# EAGLE design LED_base_left (EAGLE 9.6.2)
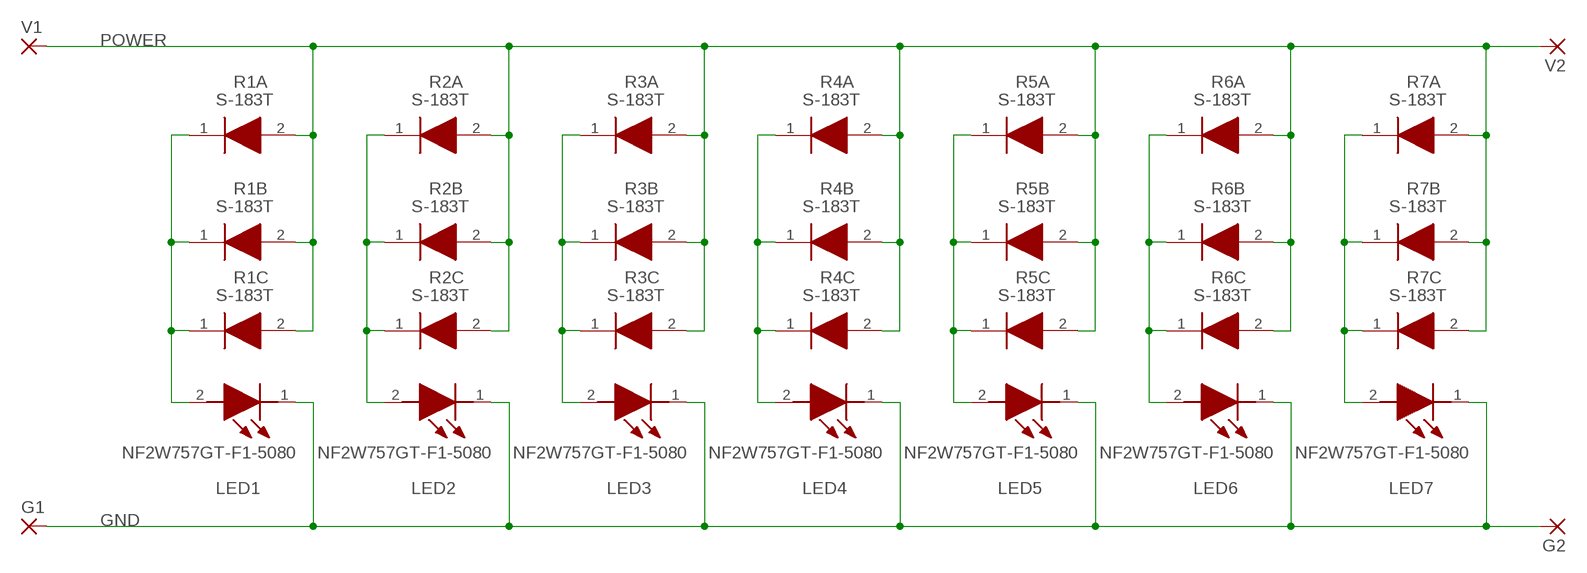
[diagram p0: schematic, sheet 1]

## Parts
G1  SMD_FULL  [SMD3.5-2.5]
G2  SMD_HALF  [SMD1.75-2.5]
LED1  NF2W757GT-F1-5080  [NF2W757DRTX]
LED2  NF2W757GT-F1-5080  [NF2W757DRTX]
LED3  NF2W757GT-F1-5080  [NF2W757DRTX]
LED4  NF2W757GT-F1-5080  [NF2W757DRTX]
LED5  NF2W757GT-F1-5080  [NF2W757DRTX]
LED6  NF2W757GT-F1-5080  [NF2W757DRTX]
LED7  NF2W757GT-F1-5080  [NF2W757DRTX]
R1A  S-183T  [SODFL3516X70NX]
R1B  S-183T  [SODFL3516X70NX]
R1C  S-183T  [SODFL3516X70NX]
R2A  S-183T  [SODFL3516X70NX]
R2B  S-183T  [SODFL3516X70NX]
R2C  S-183T  [SODFL3516X70NX]
R3A  S-183T  [SODFL3516X70NX]
R3B  S-183T  [SODFL3516X70NX]
R3C  S-183T  [SODFL3516X70NX]
R4A  S-183T  [SODFL3516X70NX]
R4B  S-183T  [SODFL3516X70NX]
R4C  S-183T  [SODFL3516X70NX]
R5A  S-183T  [SODFL3516X70NX]
R5B  S-183T  [SODFL3516X70NX]
R5C  S-183T  [SODFL3516X70NX]
R6A  S-183T  [SODFL3516X70NX]
R6B  S-183T  [SODFL3516X70NX]
R6C  S-183T  [SODFL3516X70NX]
R7A  S-183T  [SODFL3516X70NX]
R7B  S-183T  [SODFL3516X70NX]
R7C  S-183T  [SODFL3516X70NX]
V1  SMD_FULL  [SMD3.5-2.5]
V2  SMD_HALF  [SMD1.75-2.5]

## Nets
GND [PWRGND]: G1.1(P) G2.1(P) LED1.1(K) LED2.1(K) LED3.1(K) LED4.1(K) LED5.1(K) LED6.1(K) LED7.1(K)
N$1: LED1.2(A) R1A.1(K) R1B.1(K) R1C.1(K)
N$2: LED2.2(A) R2A.1(K) R2B.1(K) R2C.1(K)
N$3: LED3.2(A) R3A.1(K) R3B.1(K) R3C.1(K)
N$4: LED4.2(A) R4A.1(K) R4B.1(K) R4C.1(K)
N$5: LED5.2(A) R5A.1(K) R5B.1(K) R5C.1(K)
N$6: LED6.2(A) R6A.1(K) R6B.1(K) R6C.1(K)
N$7: LED7.2(A) R7A.1(K) R7B.1(K) R7C.1(K)
POWER [PWRGND]: R1A.2(A) R1B.2(A) R1C.2(A) R2A.2(A) R2B.2(A) R2C.2(A) R3A.2(A) R3B.2(A) R3C.2(A) R4A.2(A) R4B.2(A) R4C.2(A) R5A.2(A) R5B.2(A) R5C.2(A) R6A.2(A) R6B.2(A) R6C.2(A) R7A.2(A) R7B.2(A) R7C.2(A) V1.1(P) V2.1(P)

## Library data of the parts
G1 V1 = LED_base:SMD_FULL: SMD PAD
G2 V2 = LED_base:SMD_HALF: SMD PAD
LED1-LED7 = LED_base:NF2W757GT-F1-5080: Nichia NF2W757GT-F1-5080, 5000K Bi-colour White LED, 5080 Diffused SMD package Source: Datasheet <http://uk.rs-online.com/web/p/products/1372170>; DESCRIPTION: Nichia NF2W757GT-F1-5080, 5000K Bi-colour White LED, 5080 Diffused SMD package; HEIGHT: mm; MANUFACTURER_NAME: NICHIA; MANUFACTURER_PART_NUMBER: NF2W757GT-F1-5080; RS_PART_NUMBER: 1372170; RS_PRICE-STOCK: http://uk.rs-online.com/web/p/products/1372170
R1A R1B R1C R2A R2B R2C R3A R3B R3C R4A R4B R4C R5A R5B R5C R6A R6B R6C R7A R7B R7C = LED_base:S-183T: SEMITEC S-183T Constant Current Diode, 20mA, 4.6V max, 2-Pin SMD Source: Datasheet <https://componentsearchengine.com/Datasheets/1/S-183T.pdf>; DESCRIPTION: SEMITEC S-183T Constant Current Diode, 20mA, 4.6V max, 2-Pin SMD; HEIGHT: 0.7mm; MANUFACTURER_NAME: Semitec; MANUFACTURER_PART_NUMBER: S-183T; MOUSER_PART_NUMBER: 954-S-183T; MOUSER_PRICE-STOCK: https://www.mouser.com/Search/Refine.aspx?Keyword=954-S-183T

## Net classes
0 default: width 0.203 mm, clearance 0.203 mm
1 PWRGND: width 0.406 mm, clearance 0.203 mm to class 0, clearance 0.203 mm

## Board
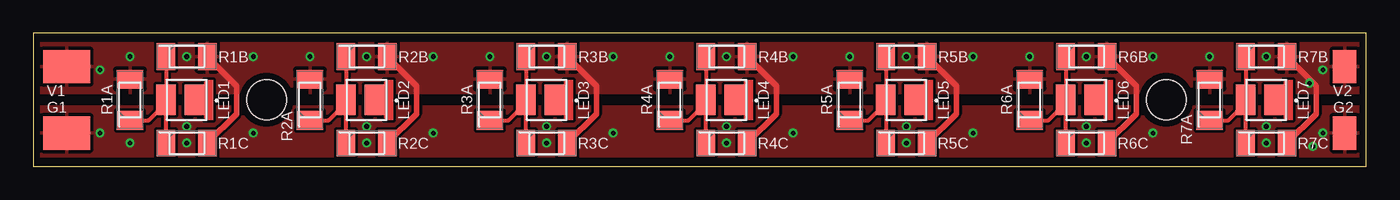
[diagram p1: board, top side]
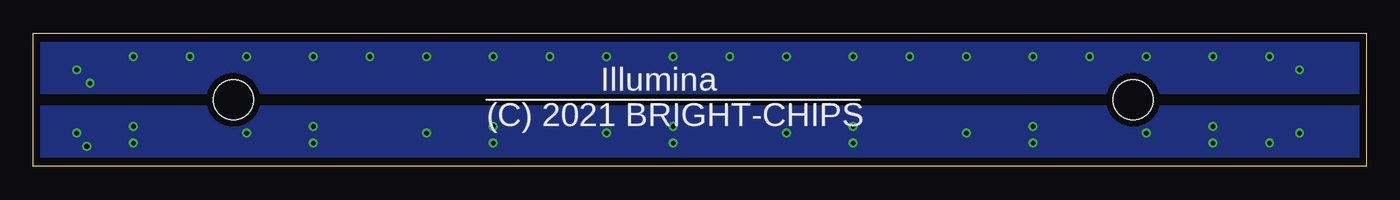
[diagram p2: board, bottom side, seen from below]

Size 100 x 10 mm. Coordinates in mm from the lower left corner, seen from the top.
Outline: 0,0 100,0 100,10 0,10 0,0
Copper layers (1*16): Top 0.035mm / dielectric 1.6mm / Bottom 0.035mm
Design rules "Elecrow_2-layer_PCB_eagle_rule": minimum track width 6mil, minimum drill 12mil, track to track 6mil, track to pad 6mil, pad to pad 6mil, via to via 8mil, smd to smd 0mil, copper to edge 20mil, drill to drill 10mil, minimum pad ring 6mil, minimum via ring 6mil, stop-mask expansion 0mil, vias tented up to drill 100mil, thermal gap 10mil
Holes 3 mm at 17.5,5 85,5

### Footprints (pad centres in the part's own frame; a part is rotated, then mirrored left to right if it is on the bottom)
SMD3.5-2.5 = smd 3.5 x 2.5: 1 1.75,1.25
SMD1.75-2.5 = smd 1.75 x 2.5: 1 0.875,1.25
NF2W757DRTX = smd 1.53 x 2.3: 1 -0.635,0 | smd 1.48 x 2.3: 2 1.56,0
SODFL3516X70NX = smd 1.4 x 2: 1 -1.55,0; 2 1.55,0

### Placement (x,y rotation side)
G1  0.75,1.25 0 top
G2  99.25,3.75 180 top
LED1  11.5,5 180 top
LED2  25,5 180 top
LED3  38.5,5 180 top
LED4  52,5 180 top
LED5  65.5,5 180 top
LED6  79,5 180 top
LED7  92.5,5 180 top
R1A  7.25,5 90 top
R1B  11.5,8.25 0 top
R1C  11.5,1.75 0 top
R2A  20.75,5 90 top
R2B  25,8.25 0 top
R2C  25,1.75 0 top
R3A  34.25,5 90 top
R3B  38.5,8.25 0 top
R3C  38.5,1.75 0 top
R4A  47.75,5 90 top
R4B  52,8.25 0 top
R4C  52,1.75 0 top
R5A  61.25,5 90 top
R5B  65.5,8.25 0 top
R5C  65.5,1.75 0 top
R6A  74.75,5 90 top
R6B  79,8.25 0 top
R6C  79,1.75 0 top
R7A  88.25,5 90 top
R7B  92.5,8.25 0 top
R7C  92.5,1.75 0 top
V1  0.75,6.25 0 top
V2  99.25,8.75 180 top

### Tracks (layer width: path | path; a pad name or v marks a point on that pad's centre or on a via)
GND  (via drill 0.35)
  other vias: 5,2.5 16.5,2.5 30,2.5 43.5,2.5 57,2.5 70.5,2.5 84,2.5 96.75,2.5 92.5,1.75 79,1.75 65.5,1.75 52,1.75 38.5,1.75 25,1.75 11.5,1.75 7.25,1.75 11.5,3 25,3 38.5,3 52,3 65.5,3 79,3 92.5,3 96,1.5
  pour Bottom: 0.5,0.75 99.5,0.75 99.5,4.5 0.5,4.5
  pour Top: 0.5,4.5 0.5,0.75 99.5,0.75 99.5,4.5
N$1
  Top 0.203: LED1.2 9.94,4.75 9.94,4.5 | R1C.1
  Top 0.305: R1B.1 LED1.2 | 9.94,4.5 R1C.1 | R1A.1 8.64,3.45 9.94,4.75
N$2
  Top 0.203: LED2.2
  Top 0.305: R2B.1 LED2.2 | LED2.2 23.44,4.75 | 23.44,4.75 R2C.1 | R2A.1 22.14,3.45 23.44,4.75
N$3
  Top 0.305: R3B.1 LED3.2 36.94,4.75 | 36.94,4.75 R3C.1 | R3A.1 35.64,3.45 36.94,4.75
N$4
  Top 0.305: R4B.1 LED4.2 50.44,4.75 | 50.44,4.75 R4C.1 | R4A.1 49.14,3.45 50.44,4.75
N$5
  Top 0.305: R5B.1 LED5.2 63.95,4.75 | 63.95,4.75 R5C.1 | R5A.1 62.65,3.45 63.95,4.75
N$6
  Top 0.305: R6B.1 LED6.2 77.44,4.75 | 77.44,4.75 R6C.1 | R6A.1 76.14,3.45 77.44,4.75
N$7
  Top 0.305: R7B.1 LED7.2 90.94,4.75 | 90.94,4.75 R7C.1 | R7A.1 89.64,3.45 90.94,4.75
POWER  (via drill 0.35)
  Top 0.406: R7B.2 96.25,6.05 96.25,3.95 R7C.2 | R6B.2 82.75,6.05 82.75,3.95 R6C.2 | R5B.2 69.25,6.05 69.25,3.95 R5C.2 | R4B.2 55.75,6.05 55.75,3.95 R4C.2 | R3B.2 42.25,6.05 42.25,3.95 R3C.2 | R2B.2 28.75,6.05 28.75,3.95 R2C.2 | R1B.2 15.25,6.05 15.25,3.95 R1C.2
  other vias: 5,7.25 7.25,8.25 20.75,8.25 34.25,8.25 47.75,8.25 61.25,8.25 74.75,8.25 88.25,8.25 96.75,7.25 16.5,8.25 30,8.25 43.5,8.25 57,8.25 70.5,8.25 84,8.25 92.5,8.25 79,8.25 65.5,8.25 52,8.25 38.5,8.25 25,8.25 11.5,8.25 95.75,6.25
  pour Bottom: 0.5,5.5 0.5,9.25 99.5,9.25 99.5,5.5
  pour Top: 0.5,9.25 0.5,5.5 99.5,5.5 99.5,9.25

### Text on the board
bPlace: Illumina / (C) 2021 BRIGHT-CHIPS